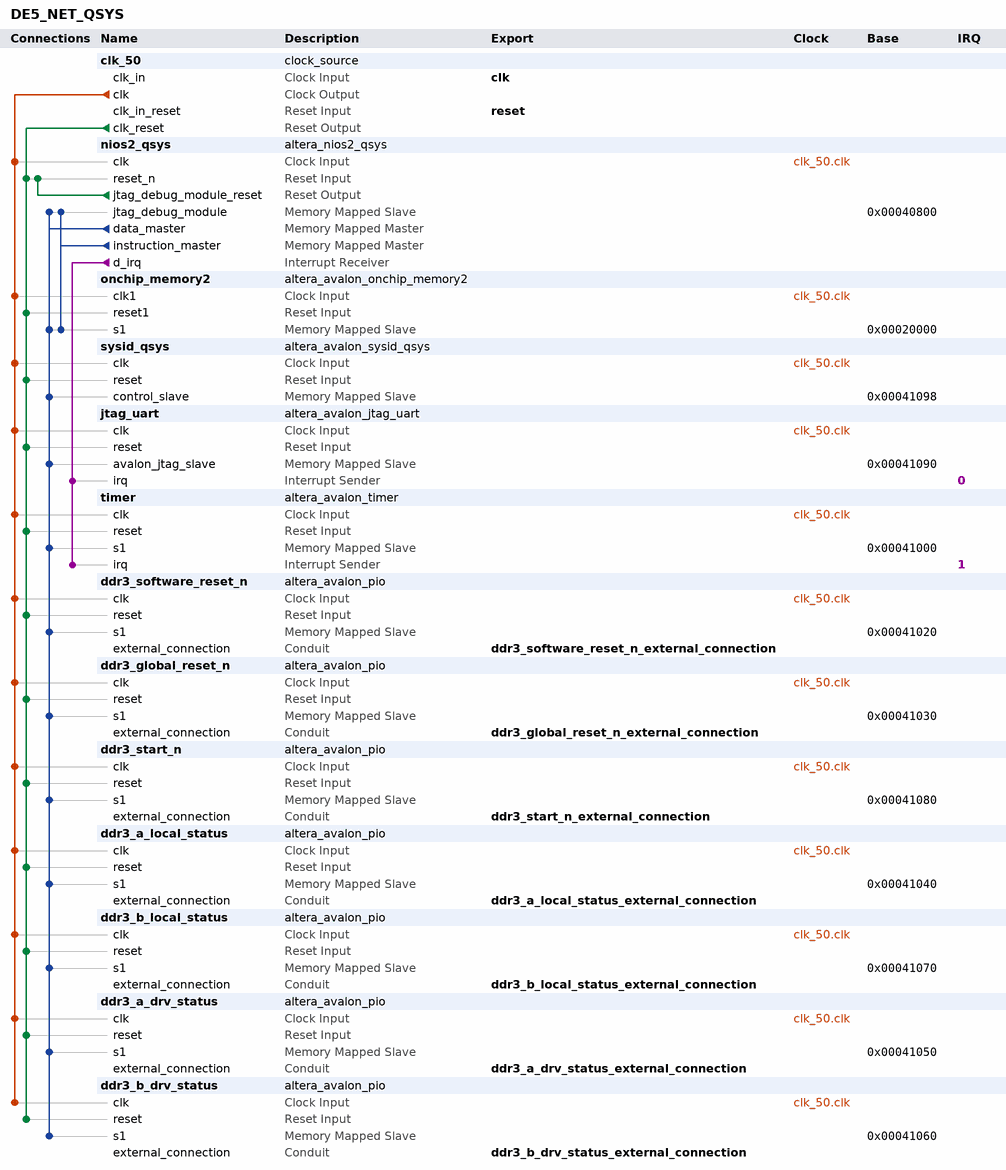
[diagram p0: system contents]
# Platform Designer (Qsys) system DE5_NET_QSYS, Stratix V 5SGXEA7N2F45C2
# Parameters at their usual value, and those the tool derives, are not listed.
package require -exact qsys 12.0
create_system DE5_NET_QSYS
set_project_property DEVICE_FAMILY {Stratix V}
set_project_property DEVICE 5SGXEA7N2F45C2

add_instance clk_50 clock_source 12.0
set_instance_parameter_value clk_50 clockFrequency 50000000

add_instance nios2_qsys altera_nios2_qsys 12.0
set_instance_parameter_value nios2_qsys resetSlave onchip_memory2.s1
set_instance_parameter_value nios2_qsys exceptionSlave onchip_memory2.s1
set_instance_parameter_value nios2_qsys breakSlave nios2_qsys.jtag_debug_module
set_instance_parameter_value nios2_qsys muldiv_multiplierType DSPBlock
set_instance_parameter_value nios2_qsys impl Fast
set_instance_parameter_value nios2_qsys icache_size 4096

add_instance onchip_memory2 altera_avalon_onchip_memory2 12.0
set_instance_parameter_value onchip_memory2 dataWidth 32
set_instance_parameter_value onchip_memory2 dualPort false
set_instance_parameter_value onchip_memory2 initMemContent true
set_instance_parameter_value onchip_memory2 initializationFileName onchip_memory2
set_instance_parameter_value onchip_memory2 memorySize 128000

add_instance sysid_qsys altera_avalon_sysid_qsys 12.0
set_instance_parameter_value sysid_qsys id 0

add_instance jtag_uart altera_avalon_jtag_uart 12.0
set_instance_parameter_value jtag_uart simInteractiveOptions INTERACTIVE_ASCII_OUTPUT

add_instance timer altera_avalon_timer 12.0
set_instance_parameter_value timer period 1
set_instance_parameter_value timer periodUnits MSEC
set_instance_parameter_value timer timerPreset CUSTOM

add_instance ddr3_software_reset_n altera_avalon_pio 12.0
set_instance_parameter_value ddr3_software_reset_n direction Output
set_instance_parameter_value ddr3_software_reset_n resetValue 1
set_instance_parameter_value ddr3_software_reset_n width 1

add_instance ddr3_global_reset_n altera_avalon_pio 12.0
set_instance_parameter_value ddr3_global_reset_n direction Output
set_instance_parameter_value ddr3_global_reset_n resetValue 1
set_instance_parameter_value ddr3_global_reset_n width 1

add_instance ddr3_start_n altera_avalon_pio 12.0
set_instance_parameter_value ddr3_start_n direction Output
set_instance_parameter_value ddr3_start_n resetValue 1
set_instance_parameter_value ddr3_start_n width 1

add_instance ddr3_a_local_status altera_avalon_pio 12.0
set_instance_parameter_value ddr3_a_local_status direction Input
set_instance_parameter_value ddr3_a_local_status width 3

add_instance ddr3_b_local_status altera_avalon_pio 12.0
set_instance_parameter_value ddr3_b_local_status direction Input
set_instance_parameter_value ddr3_b_local_status width 3

add_instance ddr3_a_drv_status altera_avalon_pio 12.0
set_instance_parameter_value ddr3_a_drv_status direction Input
set_instance_parameter_value ddr3_a_drv_status width 3

add_instance ddr3_b_drv_status altera_avalon_pio 12.0
set_instance_parameter_value ddr3_b_drv_status direction Input
set_instance_parameter_value ddr3_b_drv_status width 3

# connections
add_connection clk_50.clk ddr3_a_drv_status.clk clock
add_connection clk_50.clk ddr3_a_local_status.clk clock
add_connection clk_50.clk ddr3_b_drv_status.clk clock
add_connection clk_50.clk ddr3_b_local_status.clk clock
add_connection clk_50.clk ddr3_global_reset_n.clk clock
add_connection clk_50.clk ddr3_software_reset_n.clk clock
add_connection clk_50.clk ddr3_start_n.clk clock
add_connection clk_50.clk jtag_uart.clk clock
add_connection clk_50.clk nios2_qsys.clk clock
add_connection clk_50.clk onchip_memory2.clk1 clock
add_connection clk_50.clk sysid_qsys.clk clock
add_connection clk_50.clk timer.clk clock
add_connection clk_50.clk_reset ddr3_a_drv_status.reset reset
add_connection clk_50.clk_reset ddr3_a_local_status.reset reset
add_connection clk_50.clk_reset ddr3_b_drv_status.reset reset
add_connection clk_50.clk_reset ddr3_b_local_status.reset reset
add_connection clk_50.clk_reset ddr3_global_reset_n.reset reset
add_connection clk_50.clk_reset ddr3_software_reset_n.reset reset
add_connection clk_50.clk_reset ddr3_start_n.reset reset
add_connection clk_50.clk_reset jtag_uart.reset reset
add_connection clk_50.clk_reset nios2_qsys.reset_n reset
add_connection clk_50.clk_reset onchip_memory2.reset1 reset
add_connection clk_50.clk_reset sysid_qsys.reset reset
add_connection clk_50.clk_reset timer.reset reset
add_connection nios2_qsys.jtag_debug_module_reset nios2_qsys.reset_n reset
add_connection nios2_qsys.data_master ddr3_a_drv_status.s1 avalon
set_connection_parameter_value nios2_qsys.data_master/ddr3_a_drv_status.s1 baseAddress 0x00041050
add_connection nios2_qsys.data_master ddr3_a_local_status.s1 avalon
set_connection_parameter_value nios2_qsys.data_master/ddr3_a_local_status.s1 baseAddress 0x00041040
add_connection nios2_qsys.data_master ddr3_b_drv_status.s1 avalon
set_connection_parameter_value nios2_qsys.data_master/ddr3_b_drv_status.s1 baseAddress 0x00041060
add_connection nios2_qsys.data_master ddr3_b_local_status.s1 avalon
set_connection_parameter_value nios2_qsys.data_master/ddr3_b_local_status.s1 baseAddress 0x00041070
add_connection nios2_qsys.data_master ddr3_global_reset_n.s1 avalon
set_connection_parameter_value nios2_qsys.data_master/ddr3_global_reset_n.s1 baseAddress 0x00041030
add_connection nios2_qsys.data_master ddr3_software_reset_n.s1 avalon
set_connection_parameter_value nios2_qsys.data_master/ddr3_software_reset_n.s1 baseAddress 0x00041020
add_connection nios2_qsys.data_master ddr3_start_n.s1 avalon
set_connection_parameter_value nios2_qsys.data_master/ddr3_start_n.s1 baseAddress 0x00041080
add_connection nios2_qsys.data_master jtag_uart.avalon_jtag_slave avalon
set_connection_parameter_value nios2_qsys.data_master/jtag_uart.avalon_jtag_slave baseAddress 0x00041090
add_connection nios2_qsys.data_master nios2_qsys.jtag_debug_module avalon
set_connection_parameter_value nios2_qsys.data_master/nios2_qsys.jtag_debug_module baseAddress 0x00040800
add_connection nios2_qsys.data_master onchip_memory2.s1 avalon
set_connection_parameter_value nios2_qsys.data_master/onchip_memory2.s1 baseAddress 0x00020000
add_connection nios2_qsys.data_master sysid_qsys.control_slave avalon
set_connection_parameter_value nios2_qsys.data_master/sysid_qsys.control_slave baseAddress 0x00041098
add_connection nios2_qsys.data_master timer.s1 avalon
set_connection_parameter_value nios2_qsys.data_master/timer.s1 baseAddress 0x00041000
add_connection nios2_qsys.instruction_master nios2_qsys.jtag_debug_module avalon
set_connection_parameter_value nios2_qsys.instruction_master/nios2_qsys.jtag_debug_module baseAddress 0x00040800
add_connection nios2_qsys.instruction_master onchip_memory2.s1 avalon
set_connection_parameter_value nios2_qsys.instruction_master/onchip_memory2.s1 baseAddress 0x00020000
add_connection nios2_qsys.d_irq jtag_uart.irq interrupt
set_connection_parameter_value nios2_qsys.d_irq/jtag_uart.irq irqNumber 0
add_connection nios2_qsys.d_irq timer.irq interrupt
set_connection_parameter_value nios2_qsys.d_irq/timer.irq irqNumber 1

# exported interfaces
add_interface clk clock sink
set_interface_property clk EXPORT_OF clk_50.clk_in
add_interface reset reset sink
set_interface_property reset EXPORT_OF clk_50.clk_in_reset
add_interface ddr3_software_reset_n_external_connection conduit end
set_interface_property ddr3_software_reset_n_external_connection EXPORT_OF ddr3_software_reset_n.external_connection
add_interface ddr3_global_reset_n_external_connection conduit end
set_interface_property ddr3_global_reset_n_external_connection EXPORT_OF ddr3_global_reset_n.external_connection
add_interface ddr3_start_n_external_connection conduit end
set_interface_property ddr3_start_n_external_connection EXPORT_OF ddr3_start_n.external_connection
add_interface ddr3_b_local_status_external_connection conduit end
set_interface_property ddr3_b_local_status_external_connection EXPORT_OF ddr3_b_local_status.external_connection
add_interface ddr3_a_local_status_external_connection conduit end
set_interface_property ddr3_a_local_status_external_connection EXPORT_OF ddr3_a_local_status.external_connection
add_interface ddr3_a_drv_status_external_connection conduit end
set_interface_property ddr3_a_drv_status_external_connection EXPORT_OF ddr3_a_drv_status.external_connection
add_interface ddr3_b_drv_status_external_connection conduit end
set_interface_property ddr3_b_drv_status_external_connection EXPORT_OF ddr3_b_drv_status.external_connection

save_system DE5_NET_QSYS.qsys
